# EAGLE design SWITCHBOARD3 (EAGLE 7.7.0)
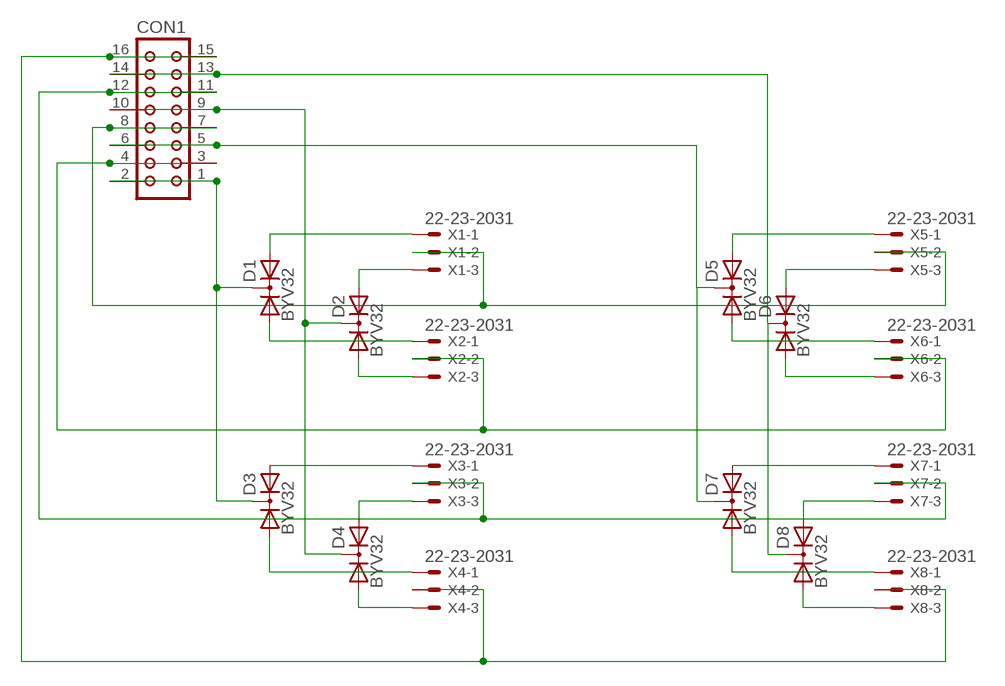
[diagram p0: schematic, sheet 1]

## Parts
CON1  CON16  [CON16]
D1  BYV32  [TO220ABS]
D2  BYV32  [TO220ABS]
D3  BYV32  [TO220ABS]
D4  BYV32  [TO220ABS]
D5  BYV32  [TO220ABS]
D6  BYV32  [TO220ABS]
D7  BYV32  [TO220ABS]
D8  BYV32  [TO220ABS]
X1  22-23-2031  [22-23-2031]
X2  22-23-2031  [22-23-2031]
X3  22-23-2031  [22-23-2031]
X4  22-23-2031  [22-23-2031]
X5  22-23-2031  [22-23-2031]
X6  22-23-2031  [22-23-2031]
X7  22-23-2031  [22-23-2031]
X8  22-23-2031  [22-23-2031]

## Nets
N$1: D1.A2 X1.1
N$2: D2.A2 X1.3
N$3: D4.A1 X4.3
N$4: D4.A2 X3.3
N$5: D1.A1 X2.1
N$6: D2.A1 X2.3
N$7: D3.A2 X3.1
N$8: D3.A1 X4.1
N$9: D5.A2 X5.1
N$10: D5.A1 X6.1
N$11: D6.A2 X5.3
N$12: D6.A1 X6.3
N$13: D7.A2 X7.1
N$14: D7.A1 X8.1
N$15: D8.A2 X7.3
N$16: D8.A1 X8.3
N$17: CON1.9 CON1.10 D2.C D4.C
N$18: CON1.1 CON1.2 D1.C D3.C
N$20: CON1.13 CON1.14 D6.C D8.C
N$21: CON1.7 CON1.8 X1.2 X5.2
N$22: CON1.3 CON1.4 X2.2 X6.2
N$23: CON1.11 CON1.12 X3.2 X7.2
N$24: CON1.15 CON1.16 X4.2 X8.2
N$26: CON1.5 CON1.6 D5.C D7.C

## Library data of the parts
CON1 = con-harting:CON16: CONNECTOR; OC_FARNELL: unknown; OC_NEWARK: unknown
D1-D8 = diode:BYV32: DIODE 2 x Si diode 200 V, 20 A/230 Apeak, 25 ns
X1-X8 = con-molex:22-23-2031: .100" (2.54mm) Center Header - 3 Pin; MF: MOLEX; MPN: 22-23-2031; OC_FARNELL: 1462950; OC_NEWARK: 30C0862

## Board
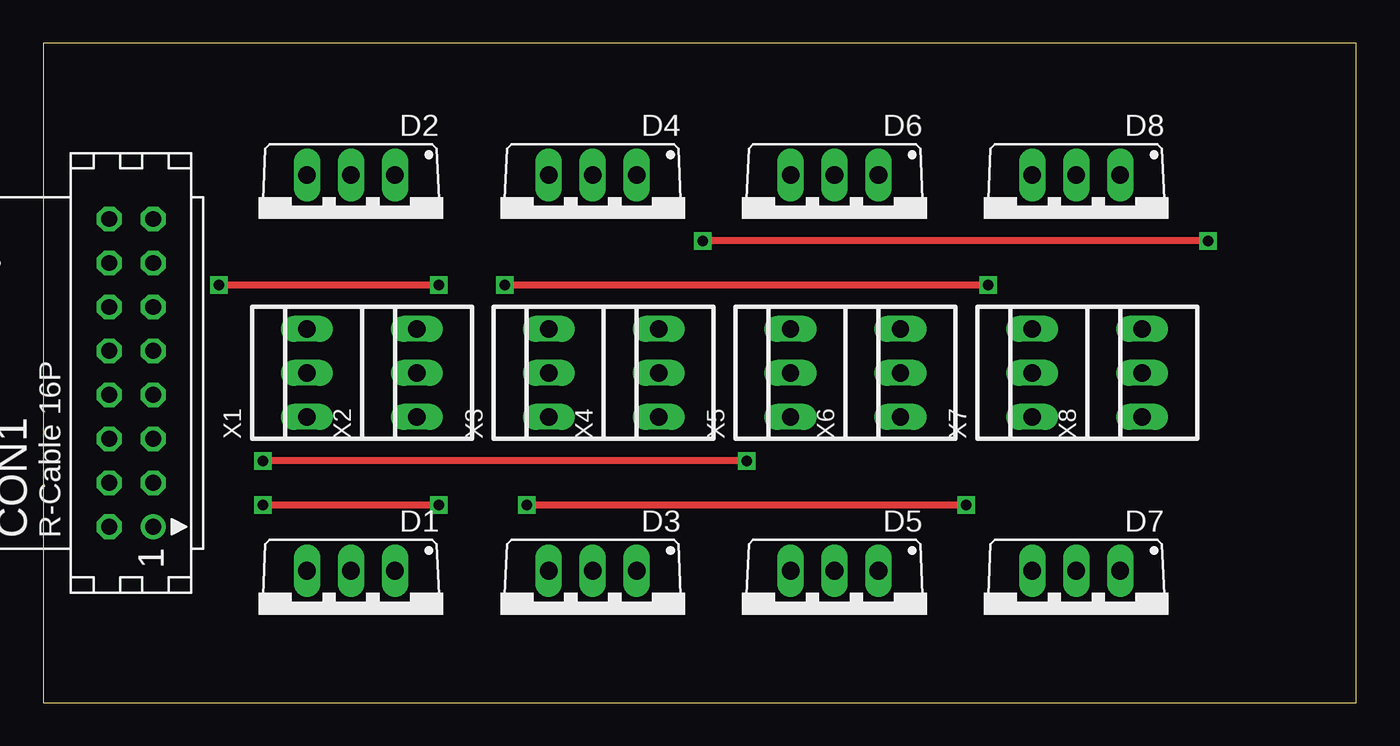
[diagram p1: board, top side]
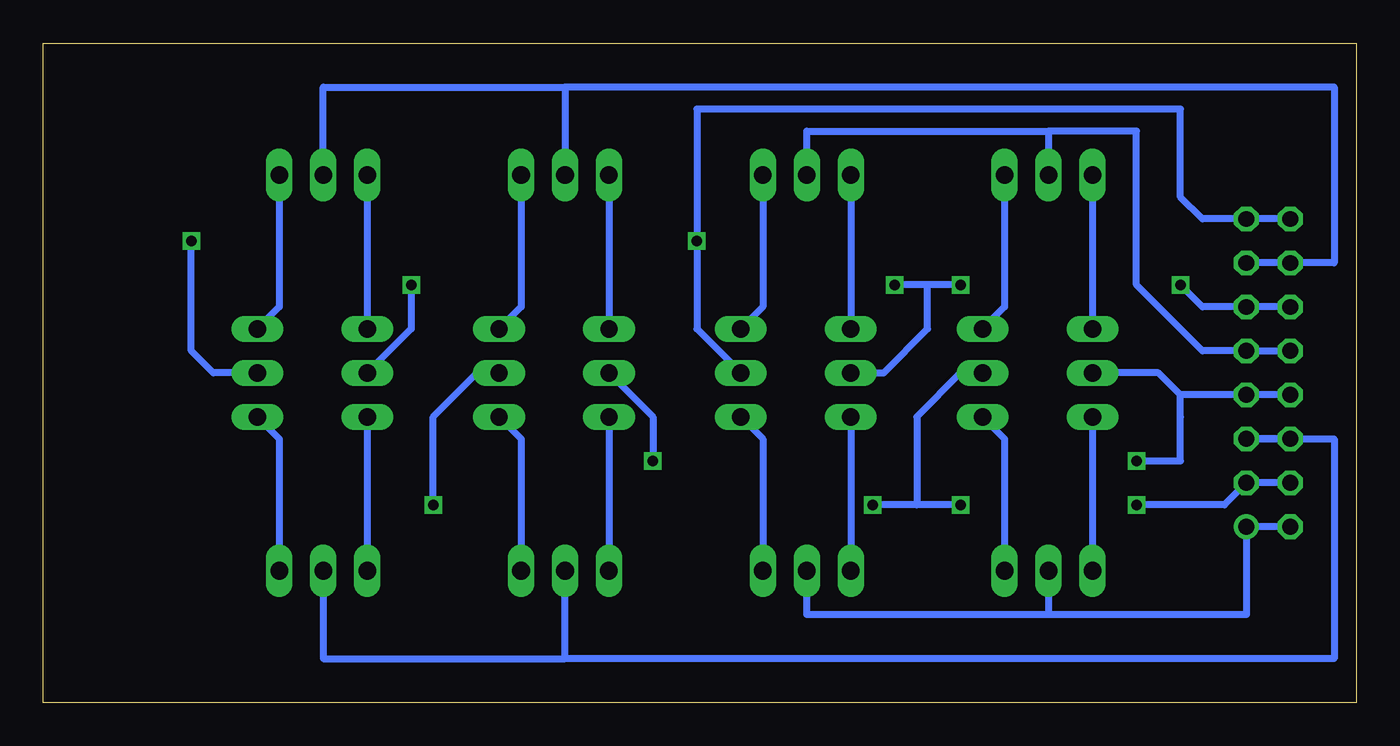
[diagram p2: board, bottom side, seen from below]

Size 75.87 x 38.09 mm. Coordinates in mm from the lower left corner, seen from the top.
Outline: 0,0 75.87,0 75.87,38.09 0,38.09 0,0
Copper layers (1*16): Top 0.035mm / dielectric 1.5mm / Bottom 0.035mm
Design rules "default *": minimum track width 10mil, minimum drill 24mil, track to track 20mil, track to pad 20mil, pad to pad 20mil, via to via 20mil, smd to smd 8mil, copper to edge 40mil, drill to drill 8mil, minimum pad ring 10mil, minimum via ring 8mil, stop-mask expansion 4mil, vias tented up to drill 0mil, thermal gap 10mil

### Footprints (pad centres in the part's own frame; a part is rotated, then mirrored left to right if it is on the bottom)
CON16 = drill 0.914: 1 -8.89,-1.27 | drill 0.914 octagon: 2 -8.89,1.27; 3 -6.35,-1.27; 4 -6.35,1.27; 5 -3.81,-1.27; 6 -3.81,1.27; 7 -1.27,-1.27; 8 -1.27,1.27; 9 1.27,-1.27; 10 1.27,1.27; 11 3.81,-1.27; 12 3.81,1.27; 13 6.35,-1.27; 14 6.35,1.27; 15 8.89,-1.27; 16 8.89,1.27
TO220ABS = drill 1.016 long: A1 -2.54,-2.54; A2 2.54,-2.54; C 0,-2.54
22-23-2031 = drill 1 long: 1 -2.54,0; 2 0,0; 3 2.54,0

### Placement (x,y rotation side)
CON1  5.08,19.05 90 top
D1  17.78,5.08 180 top
D2  17.78,27.94 180 top
D3  31.75,5.08 180 top
D4  31.75,27.94 180 top
D5  45.72,5.08 180 top
D6  45.72,27.94 180 top
D7  59.69,5.08 180 top
D8  59.69,27.94 180 top
X1  15.24,19.05 90 top
X2  21.59,19.05 90 top
X3  29.21,19.05 90 top
X4  35.56,19.05 90 top
X5  43.18,19.05 90 top
X6  49.53,19.05 90 top
X7  57.15,19.05 90 top
X8  63.5,19.05 90 top

### Tracks (layer width: path | path; a pad name or v marks a point on that pad's centre or on a via)
N$1
  Bottom 0.406: X1.1 D1.A2
N$2
  Bottom 0.406: D2.A2 X1.3
N$3
  Bottom 0.406: D4.A1 34.29,22.86 X4.3
N$4
  Bottom 0.406: D4.A2 X3.3
N$5
  Bottom 0.406: X2.1 20.32,15.24 D1.A1
N$6
  Bottom 0.406: D2.A1 20.32,22.86 X2.3
N$7
  Bottom 0.406: X3.1 D3.A2
N$8
  Bottom 0.406: X4.1 34.29,15.24 D3.A1
N$9
  Bottom 0.406: X5.1 D5.A2
N$10
  Bottom 0.406: X6.1 48.26,15.24 D5.A1
N$11
  Bottom 0.406: D6.A2 X5.3
N$12
  Bottom 0.406: D6.A1 48.26,22.86 X6.3
N$13
  Bottom 0.406: X7.1 D7.A2
N$14
  Bottom 0.406: X8.1 62.23,15.24 D7.A1
N$15
  Bottom 0.406: D8.A2 X7.3
N$16
  Bottom 0.406: D8.A1 62.23,22.86 X8.3
N$17
  Bottom 0.406: CON1.10 CON1.9 8.89,20.32 12.7,24.13 12.7,33.02 17.78,33.02 | D4.C 31.75,33.02 17.78,33.02 | 17.78,33.02 D2.C
N$18
  Bottom 0.406: CON1.2 CON1.1 6.35,5.08 17.78,5.08 | 17.78,5.08 31.75,5.08 D3.C | D1.C 17.78,5.08
N$20
  Bottom 0.406: CON1.13 CON1.14 1.27,25.4 1.27,35.56 45.72,35.56 | 45.72,35.56 D6.C | D8.C 59.69,35.56 45.72,35.56
N$21  (via drill 0.6)
  Top 0.406: v40.64,13.97 v12.7,13.97
  Bottom 0.406: CON1.8 CON1.7 10.16,17.78 | 10.16,17.78 10.16,16.51 10.16,13.97 v12.7,13.97 | 10.16,17.78 11.43,19.05 X1.2 | X5.2 40.64,16.51 v40.64,13.97
N$22  (via drill 0.6)
  Top 0.406: v12.7,11.43 v22.86,11.43 | v27.94,11.43 v53.34,11.43
  Bottom 0.406: CON1.4 CON1.3 7.62,11.43 v12.7,11.43 | v22.86,11.43 25.4,11.43 | 25.4,11.43 v27.94,11.43 | v53.34,11.43 53.34,16.51 50.8,19.05 X6.2 | X2.2 22.86,19.05 25.4,16.51 25.4,11.43
N$23  (via drill 0.6)
  Top 0.406: v10.16,24.13 v22.86,24.13 | v26.67,24.13 v54.61,24.13
  Bottom 0.406: CON1.12 CON1.11 8.89,22.86 v10.16,24.13 | v22.86,24.13 24.77,24.13 | 24.77,24.13 v26.67,24.13 | v54.61,24.13 54.61,21.59 X7.2 | X3.2 27.3,19.05 24.77,21.59 24.77,24.13
N$24  (via drill 0.6)
  Top 0.406: v67.31,26.67 v38.1,26.67
  Bottom 0.406: CON1.16 CON1.15 8.89,27.94 10.16,29.21 10.16,34.29 38.1,34.29 v38.1,26.67 38.1,21.59 X4.2 | X8.2 66.04,19.05 67.31,20.32 v67.31,26.67
N$26
  Bottom 0.406: CON1.6 CON1.5 1.27,15.24 1.27,2.54 45.72,2.54 | 45.72,2.54 D5.C | D7.C 59.69,2.54 45.72,2.54